# EAGLE design El-Fueradoro_Zuendbox (EAGLE 6.6.0)
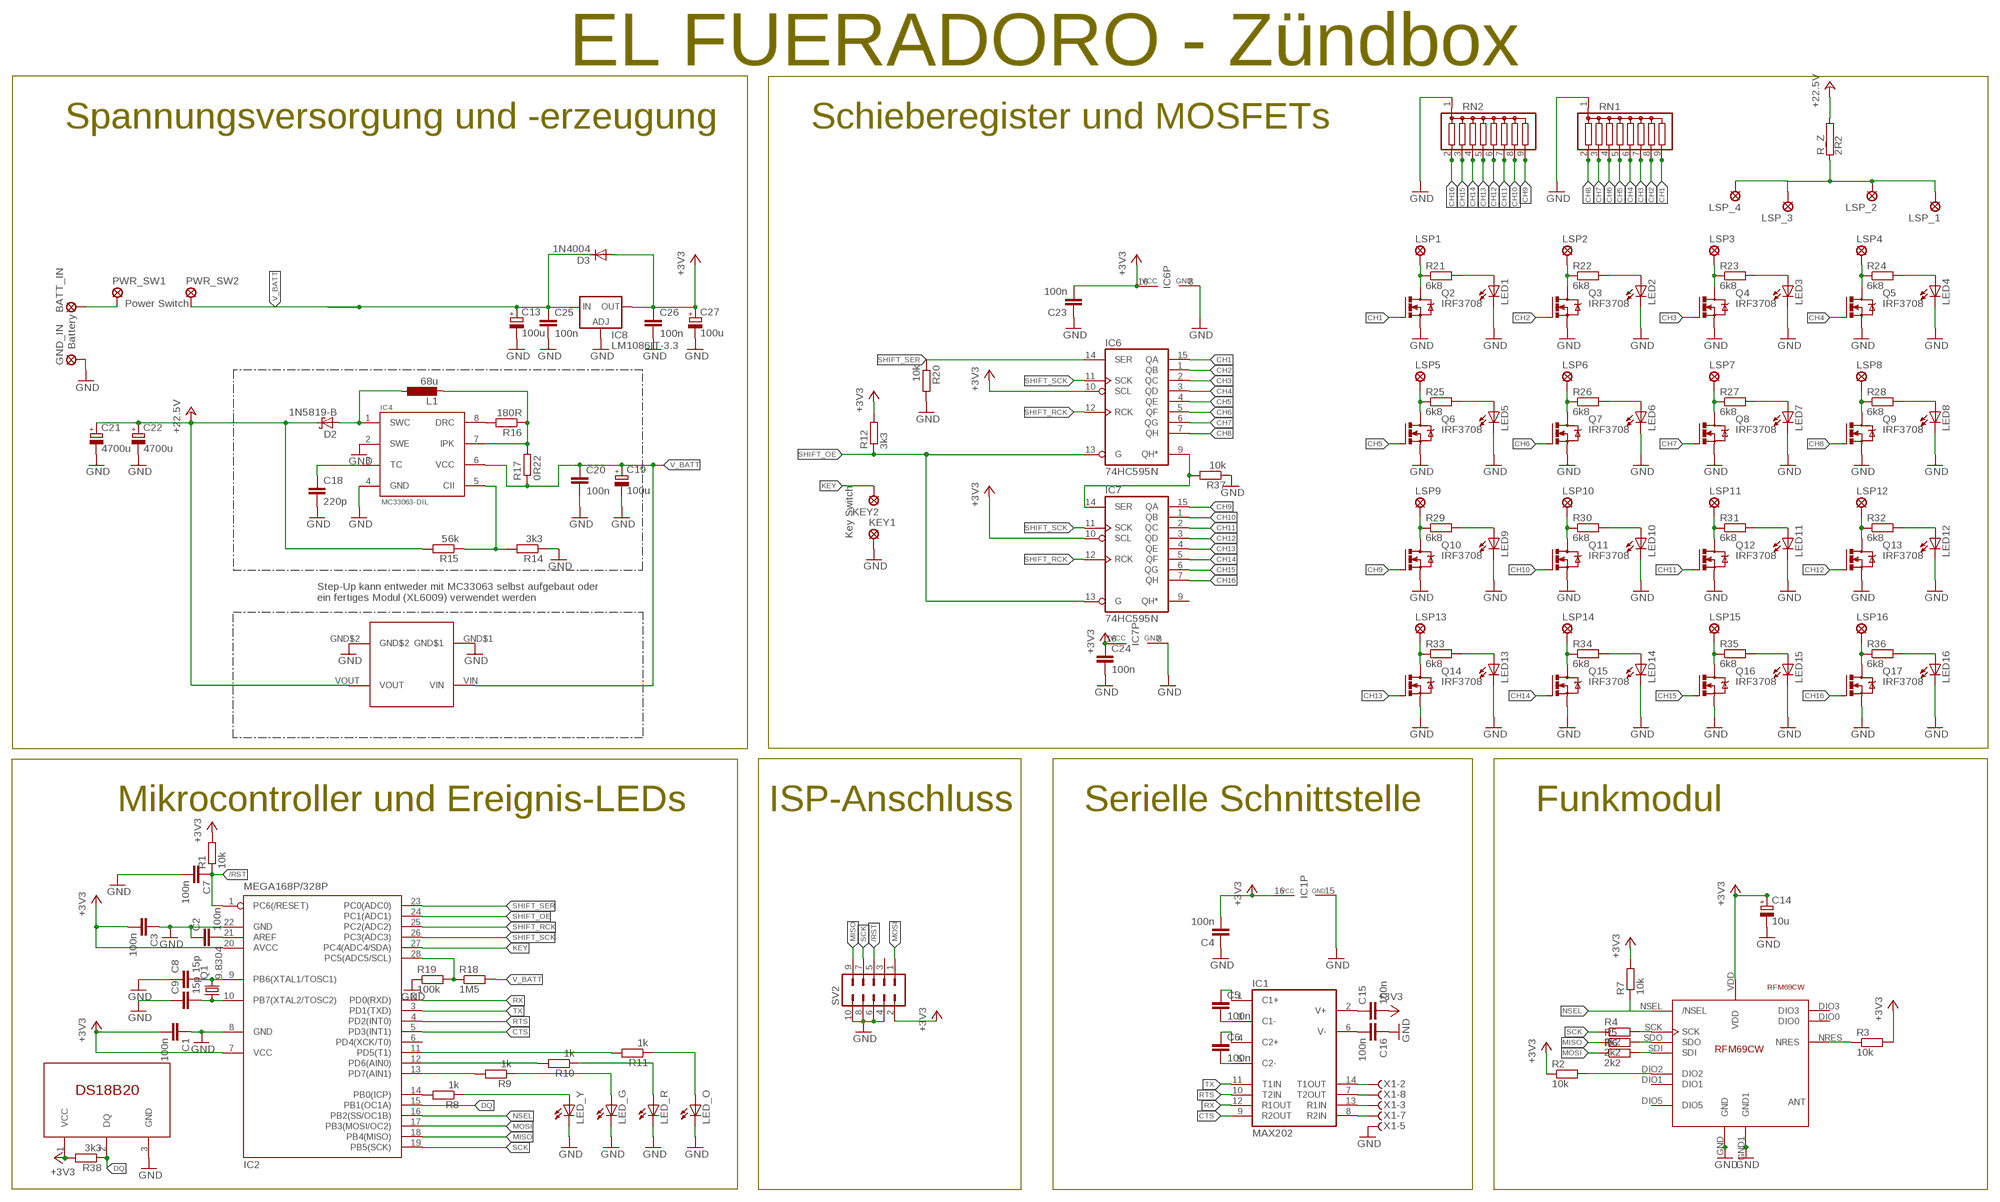
[diagram p0: schematic, sheet 1]

## Parts
BATT_IN  LSP10  [LSP10]
C1  100n  C-EU025-024X044  [C025-024X044]
C2  100n  C-EU025-024X044  [C025-024X044]
C3  100n  C-EU025-024X044  [C025-024X044]
C4  100n  C-EU025-024X044  [C025-024X044]
C5  100n  C-EU025-024X044  [C025-024X044]
C6  100n  C-EU025-024X044  [C025-024X044]
C7  100n  C-EU025-024X044  [C025-024X044]
C8  15p  C-EU025-024X044  [C025-024X044]
C9  15p  C-EU025-024X044  [C025-024X044]
C13  100u  CPOL-EUB45181A  [B45181A]
C14  10u  CPOL-EUB45181A  [B45181A]
C15  100n  C-EU025-024X044  [C025-024X044]
C16  100n  C-EU025-024X044  [C025-024X044]
C18  220p  C-EU025-024X044  [C025-024X044]
C19  100u  CPOL-EUE2,5-6E  [E2,5-6E]
C20  100n  C-EU025-024X044  [C025-024X044]
C21  4700u  CPOL-EUE7.5-18  [E7,5-18]
C22  4700u  CPOL-EUE7.5-18  [E7,5-18]
C23  100n  C-EU025-024X044  [C025-024X044]
C24  100n  C-EU025-024X044  [C025-024X044]
C25  100n  C-EU025-024X044  [C025-024X044]
C26  100n  C-EU025-024X044  [C025-024X044]
C27  100u  CPOL-EUB45181A  [B45181A]
D2  1N5819-B  [DO41-7.6]
D3  1N4004  [DO41-10]
GND_IN  LSP10  [LSP10]
IC1  MAX202  MAX232  [DIL16]
IC2  MEGA168P/328P  MEGA8-P  [DIL28-3]
IC4  MC33063-DIL  MC34063-DIL  [DIL08]
IC6  74HC595N  [DIL16]
IC7  74HC595N  [DIL16]
IC8  LM1086IT-3.3  LD117AV  [TO220L1]
KEY1  LSP10  [LSP10]
KEY2  LSP10  [LSP10]
L1  68u  L-EU0204/5  [0204/5]
LED1  LED3MM  [LED3MM]
LED2  LED3MM  [LED3MM]
LED3  LED3MM  [LED3MM]
LED4  LED3MM  [LED3MM]
LED5  LED3MM  [LED3MM]
LED6  LED3MM  [LED3MM]
LED7  LED3MM  [LED3MM]
LED8  LED3MM  [LED3MM]
LED9  LED3MM  [LED3MM]
LED10  LED3MM  [LED3MM]
LED11  LED3MM  [LED3MM]
LED12  LED3MM  [LED3MM]
LED13  LED3MM  [LED3MM]
LED14  LED3MM  [LED3MM]
LED15  LED3MM  [LED3MM]
LED16  LED3MM  [LED3MM]
LED_G  LED5MM  [LED5MM]
LED_O  LED5MM  [LED5MM]
LED_R  LED5MM  [LED5MM]
LED_Y  LED5MM  [LED5MM]
LSP1  LSP11  [LSP11]
LSP2  LSP11  [LSP11]
LSP3  LSP11  [LSP11]
LSP4  LSP11  [LSP11]
LSP5  LSP11  [LSP11]
LSP6  LSP11  [LSP11]
LSP7  LSP11  [LSP11]
LSP8  LSP11  [LSP11]
LSP9  LSP11  [LSP11]
LSP10  LSP11  [LSP11]
LSP11  LSP11  [LSP11]
LSP12  LSP11  [LSP11]
LSP13  LSP11  [LSP11]
LSP14  LSP11  [LSP11]
LSP15  LSP11  [LSP11]
LSP16  LSP11  [LSP11]
LSP_1  LSP11  [LSP11]
LSP_2  LSP11  [LSP11]
LSP_3  LSP11  [LSP11]
LSP_4  LSP11  [LSP11]
PWR_SW1  LSP10  [LSP10]
PWR_SW2  LSP10  [LSP10]
Q1  9.8304  CRYSTALHC49S  [HC49/S]
Q2  IRF3708  IRF530  [TO220BV]
Q3  IRF3708  IRF530  [TO220BV]
Q4  IRF3708  IRF530  [TO220BV]
Q5  IRF3708  IRF530  [TO220BV]
Q6  IRF3708  IRF530  [TO220BV]
Q7  IRF3708  IRF530  [TO220BV]
Q8  IRF3708  IRF530  [TO220BV]
Q9  IRF3708  IRF530  [TO220BV]
Q10  IRF3708  IRF530  [TO220BV]
Q11  IRF3708  IRF530  [TO220BV]
Q12  IRF3708  IRF530  [TO220BV]
Q13  IRF3708  IRF530  [TO220BV]
Q14  IRF3708  IRF530  [TO220BV]
Q15  IRF3708  IRF530  [TO220BV]
Q16  IRF3708  IRF530  [TO220BV]
Q17  IRF3708  IRF530  [TO220BV]
R1  10k  R-EU_0207/10  [0207/10]
R2  10k  R-EU_0207/10  [0207/10]
R3  10k  R-EU_0207/10  [0207/10]
R4  2k2  R-EU_0207/10  [0207/10]
R5  2k2  R-EU_0207/10  [0207/10]
R6  2k2  R-EU_0207/10  [0207/10]
R7  10k  R-EU_0207/10  [0207/10]
R8  1k  R-EU_0207/10  [0207/10]
R9  1k  R-EU_0207/10  [0207/10]
R10  1k  R-EU_0207/10  [0207/10]
R11  1k  R-EU_0207/10  [0207/10]
R12  3k3  R-EU_0207/10  [0207/10]
R14  3k3  R-EU_0207/10  [0207/10]
R15  56k  R-EU_0207/10  [0207/10]
R16  180R  R-EU_0207/10  [0207/10]
R17  0R22  R-EU_0207/10  [0207/10]
R18  1M5  R-EU_0207/10  [0207/10]
R19  100k  R-EU_0207/10  [0207/10]
R20  10k  R-EU_0207/10  [0207/10]
R21  6k8  R-EU_0207/10  [0207/10]
R22  6k8  R-EU_0207/10  [0207/10]
R23  6k8  R-EU_0207/10  [0207/10]
R24  6k8  R-EU_0207/10  [0207/10]
R25  6k8  R-EU_0207/10  [0207/10]
R26  6k8  R-EU_0207/10  [0207/10]
R27  6k8  R-EU_0207/10  [0207/10]
R28  6k8  R-EU_0207/10  [0207/10]
R29  6k8  R-EU_0207/10  [0207/10]
R30  6k8  R-EU_0207/10  [0207/10]
R31  6k8  R-EU_0207/10  [0207/10]
R32  6k8  R-EU_0207/10  [0207/10]
R33  6k8  R-EU_0207/10  [0207/10]
R34  6k8  R-EU_0207/10  [0207/10]
R35  6k8  R-EU_0207/10  [0207/10]
R36  6k8  R-EU_0207/10  [0207/10]
R37  10k  R-EU_0207/10  [0207/10]
R38  3k3  R-EU_0207/10  [0207/10]
R_Z  2R2  RKH214-8R  [KH214R-8]
RN1  G08R  [SIL9]
RN2  G08R  [SIL9]
SV2  ML10  [ML10]
U$2  DS18B20  [TO92-LINE]
U$3  XL6009_MODULED  [XL6009_PACK]
U$4  RFM69CW  [RFM69CW]
X1  F09HPS  [F09HP]

## Nets
+3V3: C1.2 C3.2 C4.2 C14.+ C15.2 C23.2 C24.1 C26.1 C27.+ D3.A IC1.16(VCC) IC2.7(VCC) IC2.20(AVCC) IC6.10(SCL) IC6.16(VCC) IC7.10(SCL) IC7.16(VCC) IC8.2(OUT) R1.2 R2.1 R3.2 R7.2 R12.2 R38.2 SV2.2 U$2.1(VCC) U$4.VDD
+22_5V: C21.+ C22.+ D2.C R15.2 R_Z.2 U$3.VOUT ; supply symbol labelled +22.5V
/RST: C7.1 IC2.1(PC6(/RESET)) R1.1 SV2.5
CH1: IC6.15(QA) Q2.G RN1.9
CH2: IC6.1(QB) Q3.G RN1.8
CH3: IC6.2(QC) Q4.G RN1.7
CH4: IC6.3(QD) Q5.G RN1.6
CH5: IC6.4(QE) Q6.G RN1.5
CH6: IC6.5(QF) Q7.G RN1.4
CH7: IC6.6(QG) Q8.G RN1.3
CH8: IC6.7(QH) Q9.G RN1.2
CH9: IC7.15(QA) Q10.G RN2.9
CH10: IC7.1(QB) Q11.G RN2.8
CH11: IC7.2(QC) Q12.G RN2.7
CH12: IC7.3(QD) Q13.G RN2.6
CH13: IC7.4(QE) Q14.G RN2.5
CH14: IC7.5(QF) Q15.G RN2.4
CH15: IC7.6(QG) Q16.G RN2.3
CH16: IC7.7(QH) Q17.G RN2.2
CTS: IC1.9(R2OUT) IC2.5(PD3(INT1))
DQ: IC2.15(PB1(OC1A)) R38.1 U$2.2(DQ)
GND: C1.1 C2.1 C3.1 C4.1 C7.2 C8.1 C9.1 C13.- C14.- C16.1 C18.2 C19.- C20.2 C21.- C22.- C23.1 C24.2 C25.2 C26.2 C27.- GND_IN.MP IC1.15(GND) IC2.8(GND) IC2.22(GND) IC4.2(SWE) IC4.4(GND) IC6.8(GND) IC7.8(GND) IC8.1(ADJ) KEY1.MP LED1.K(C) LED2.K(C) LED3.K(C) LED4.K(C) LED5.K(C) LED6.K(C) LED7.K(C) LED8.K(C) LED9.K(C) LED10.K(C) LED11.K(C) LED12.K(C) LED13.K(C) LED14.K(C) LED15.K(C) LED16.K(C) LED_G.K(C) LED_O.K(C) LED_R.K(C) LED_Y.K(C) Q2.S Q3.S Q4.S Q5.S Q6.S Q7.S Q8.S Q9.S Q10.S Q11.S Q12.S Q13.S Q14.S Q15.S Q16.S Q17.S R14.1 R19.1 R20.2 R37.1 RN1.1 RN2.1 SV2.4 SV2.6 SV2.8 SV2.10 U$2.3(GND) U$3.GND$1 U$3.GND$2 U$4.GND U$4.GND1 X1.5(-5:F)
KEY: IC2.27(PC4(ADC4/SDA)) KEY2.MP
MISO: IC2.18(PB4(MISO)) R5.1 SV2.9
MOSI: IC2.17(PB3(MOSI/OC2)) R6.1 SV2.1
N$1: BATT_IN.MP PWR_SW1.MP
N$9: R2.2 U$4.DIO2
N$10: R4.2 U$4.SCK
N$11: R5.2 U$4.SDO
N$12: R6.2 U$4.SDI
N$13: R3.1 U$4.NRES
N$17: C2.2 IC2.21(AREF)
N$18: C9.2 IC2.10(PB7(XTAL2/TOSC2)) Q1.1
N$19: C5.1 IC1.1(C1+)
N$20: C5.2 IC1.3(C1-)
N$21: C6.1 IC1.4(C2+)
N$22: C6.2 IC1.5(C2-)
N$23: C8.2 IC2.9(PB6(XTAL1/TOSC1)) Q1.2
N$27: IC2.13(PD7(AIN1)) R9.2
N$28: IC2.12(PD6(AIN0)) R10.2
N$29: IC2.11(PD5(T1)) R11.2
N$30: LED_O.A R11.1
N$31: IC2.14(PB0(ICP)) R8.2
N$32: LED_R.A R10.1
N$33: LED_G.A R9.1
N$34: LED_Y.A R8.1
N$35: LSP_1.MP LSP_2.MP LSP_3.MP LSP_4.MP R_Z.1
N$37: IC2.28(PC5(ADC5/SCL)) R18.1 R19.2
N$43: C15.1 IC1.2(V+)
N$44: C16.2 IC1.6(V-)
N$45: D2.A IC4.1(SWC) L1.1
N$46: IC4.5(CII) R14.2 R15.1
N$47: IC4.8(DRC) R16.2
N$48: C18.1 IC4.3(TC)
N$49: IC4.7(IPK) L1.2 R16.1 R17.2
N$51: IC6.9(QH*) IC7.14(SER) R37.2
N$52: LSP1.MP Q2.D R21.1
N$53: LSP2.MP Q3.D R22.1
N$54: LSP3.MP Q4.D R23.1
N$55: LSP4.MP Q5.D R24.1
N$56: LSP5.MP Q6.D R25.1
N$57: LSP6.MP Q7.D R26.1
N$58: LSP7.MP Q8.D R27.1
N$59: LSP8.MP Q9.D R28.1
N$60: LSP9.MP Q10.D R29.1
N$61: LSP10.MP Q11.D R30.1
N$62: LSP11.MP Q12.D R31.1
N$63: LSP12.MP Q13.D R32.1
N$64: LSP13.MP Q14.D R33.1
N$65: LSP14.MP Q15.D R34.1
N$66: LSP15.MP Q16.D R35.1
N$67: LSP16.MP Q17.D R36.1
N$72: LED1.A R21.2
N$73: LED2.A R22.2
N$74: LED3.A R23.2
N$75: LED4.A R24.2
N$76: LED5.A R25.2
N$77: LED6.A R26.2
N$78: LED7.A R27.2
N$79: LED8.A R28.2
N$80: LED9.A R29.2
N$81: LED10.A R30.2
N$82: LED11.A R31.2
N$83: LED12.A R32.2
N$84: LED13.A R33.2
N$85: LED14.A R34.2
N$86: LED15.A R35.2
N$87: LED16.A R36.2
NSEL: IC2.16(PB2(SS/OC1B)) R7.1 U$4.NSEL(/NSEL)
PC_CTS_IN: IC1.7(T2OUT) X1.8(-8:F)
PC_RTS_OUT: IC1.8(R2IN) X1.7(-7:F)
PC_RX_IN: IC1.14(T1OUT) X1.2(-2:F)
PC_TX_OUT: IC1.13(R1IN) X1.3(-3:F)
RTS: IC1.10(T2IN) IC2.4(PD2(INT0))
RX: IC1.12(R1OUT) IC2.2(PD0(RXD))
SCK: IC2.19(PB5(SCK)) R4.1 SV2.7
SHIFT_OE: IC2.24(PC1(ADC1)) IC6.13(G) IC7.13(G) R12.1
SHIFT_RCK: IC2.25(PC2(ADC2)) IC6.12(RCK) IC7.12(RCK)
SHIFT_SCK: IC2.26(PC3(ADC3)) IC6.11(SCK) IC7.11(SCK)
SHIFT_SER: IC2.23(PC0(ADC0)) IC6.14(SER) R20.1
TX: IC1.11(T1IN) IC2.3(PD1(TXD))
V_BATT: C13.+ C19.+ C20.1 C25.1 D3.C IC4.6(VCC) IC8.3(IN) PWR_SW2.MP R17.1 R18.2 U$3.VIN
Unconnected: IC2.6(PD4(XCK/T0)) IC7.9(QH*) SV2.3 U$4.DIO0 U$4.DIO1 U$4.DIO3 U$4.DIO5 X1.1(-1:F) X1.4(-4:F) X1.6(-6:F) X1.9(-9:F) X1.G1(-G:G1) X1.G2(-G:G2)

## Notes on the sheet
- EL FUERADORO - Zündbox
- Spannungsversorgung und -erzeugung | Schieberegister und MOSFETs
- Power Switch
- Battery
- Key Switch
- Step-Up kann entweder mit MC33063 selbst aufgebaut oder
  ein fertiges Modul (XL6009) verwendet werden
- Mikrocontroller und Ereignis-LEDs | ISP-Anschluss | Serielle Schnittstelle | Funkmodul

## Library data of the parts
BATT_IN GND_IN KEY1 KEY2 PWR_SW1 PWR_SW2 = solpad:LSP10: SOLDER PAD drill 1.0 mm, distributor Buerklin, 12H555
C1-C9 C15 C16 C18 C20 C23-C26 = rcl:C-EU: CAPACITOR, European symbol
C13 C14 C19 C21 C22 C27 = rcl:CPOL-EU: POLARIZED CAPACITOR, European symbol
D2 = diode:1N581*: 1.0A SCHOTTKY BARRIER RECTIFIER Source: http://www.diodes.com/datasheets/ds23001.pdf
D3 = diode:1N4004: DIODE general purpose rectifier, 1 A
IC1 = maxim:MAX232: RS232 TRANSCEIVER; MF: MAXIM; MPN: MAX232ACPE+; OC_FARNELL: 9723773; OC_NEWARK: 68K4544
IC2 = atmel:MEGA8-P: MICROCONTROLLER 8 Kbytes FLASH, 1 kbytes SRAM, 512 bytes EEPROM, USART, 4-channel 10 bit ADC, 2-channel 8 bit ADC Pin compatible with Atmega48, ATMega88, ATMega168 Source: avr.lbr; OC_FARNELL: unknown; OC_NEWARK: unknown
IC4 = mc34063:MC34063-DIL: DC/DC converter MC34063 in DIL08.
IC6 IC7 = 74xx-eu:74*595: 8-bit SHIFT REGISTER, output latch
IC8 = v-reg:LD117A?*: Low drop fixed and adjustable positive voltage regulators 1 A Source: http://www.st.com/stonline/products/literature/ds/7194/ld1117axx.pdf
L1 = rcl:L-EU: INDUCTOR, European symbol
LED1-LED16 LED_G LED_O LED_R LED_Y = led:LED: LED OSRAM: - CHIPLED LG R971, LG N971, LY N971, LG Q971, LY Q971, LO R971, LY R971 LH N974, LH R974 LS Q976, LO Q976, LY Q976 LO Q996 - Hyper CHIPLED LW Q18S LB Q993, LB Q99A, LB R99A - SideLED LS A670, LO A670, LY A670, LG A670, LP A670 LB A673, LV A673, LT A673, LW A673 LH A674 LY A675 LS A676, LA A676, LO A676, LY A676, LW A676 LS A679, LY A679, LG A679 - Hyper Micro SIDELED® LS Y876, LA Y876, LO Y876, LY Y876 LT Y87S - SmartLED LW L88C, LW L88S LB L89C, LB L89S, LG L890 LS L89K, LO L89K, LY L89K LS L896, LA L896, LO L896, LY L896 - TOPLED LS T670, LO T670, LY T670, LG T670, LP T670 LSG T670, LSP T670, LSY T670, LOP T670, LYG T670 LG T671, LOG T671, LSG T671 LB T673, LV T673, LT T673, LW T673 LH T674 LS T676, LA T676, LO T676, LY T676, LB T676, LH T676, LSB T676, LW T676 LB T67C, LV T67C, LT T67C, LS T67K, LO T67K, LY T67K, LW E67C LS E67B, LA E67B, LO E67B, LY E67B, LB E67C, LV E67C, LT E67C LW T67C LS T679, LY T679, LG T679 LS T770, LO T770, LY T770, LG T770, LP T770 LB T773, LV T773, LT T773, LW T773 LH T774 LS E675, LA E675, LY E675, LS T675 LS T776, LA T776, LO T776, LY T776, LB T776 LHGB T686 LT T68C, LB T68C - Hyper Mini TOPLED® LB M676 - Mini TOPLED Santana® LG M470 LS M47K, LO M47K, LY M47K Source: http://www.osram.convergy.de LUXEON: - LUMILED® LXK2-PW12-R00, LXK2-PW12-S00, LXK2-PW14-U00, LXK2-PW14-V00 LXK2-PM12-R00, LXK2-PM12-S00, LXK2-PM14-U00 LXK2-PE12-Q00, LXK2-PE12-R00, LXK2-PE12-S00, LXK2-PE14-T00, LXK2-PE14-U00 LXK2-PB12-K00, LXK2-PB12-L00, LXK2-PB12-M00, LXK2-PB14-N00, LXK2-PB14-P00, LXK2-PB14-Q00 LXK2-PR12-L00, LXK2-PR12-M00, LXK2-PR14-Q00, LXK2-PR14-R00 LXK2-PD12-Q00, LXK2-PD12-R00, LXK2-PD12-S00 LXK2-PH12-R00, LXK2-PH12-S00 LXK2-PL12-P00, LXK2-PL12-Q00, LXK2-PL12-R00 Source: www.luxeon.com KINGBRIGHT: KA-3528ASYC Source: www.kingbright.com
LSP1-LSP16 LSP_1-LSP_4 = solpad:LSP11: SOLDER PAD drill 1.1 mm
Q1 = crystal:CRYSTAL: CRYSTAL; OC_FARNELL: 1667008; OC_NEWARK: unknown
Q2-Q17 = transistor-power:IRF530: HEXFET Power MOSFET
R1-R12 R14-R38 = rcl:R-EU_: RESISTOR, European symbol
R_Z = resistor-power:R: Power Resitor; OC_FARNELL: unknown; OC_NEWARK: unknown
RN1 RN2 = resistor-sil:G08R: SIL RESISTOR; OC_FARNELL: unknown; OC_NEWARK: unknown
SV2 = fp:ML10: HARTING; OC_FARNELL: unknown; OC_NEWARK: unknown
U$2 = fp:DS18B20
U$3 = fp:XL6009_MODULE
U$4 = fp:RFM69CW
X1 = fp:F09HPS: SUB-D; OC_FARNELL: unknown; OC_NEWARK: unknown

## Board
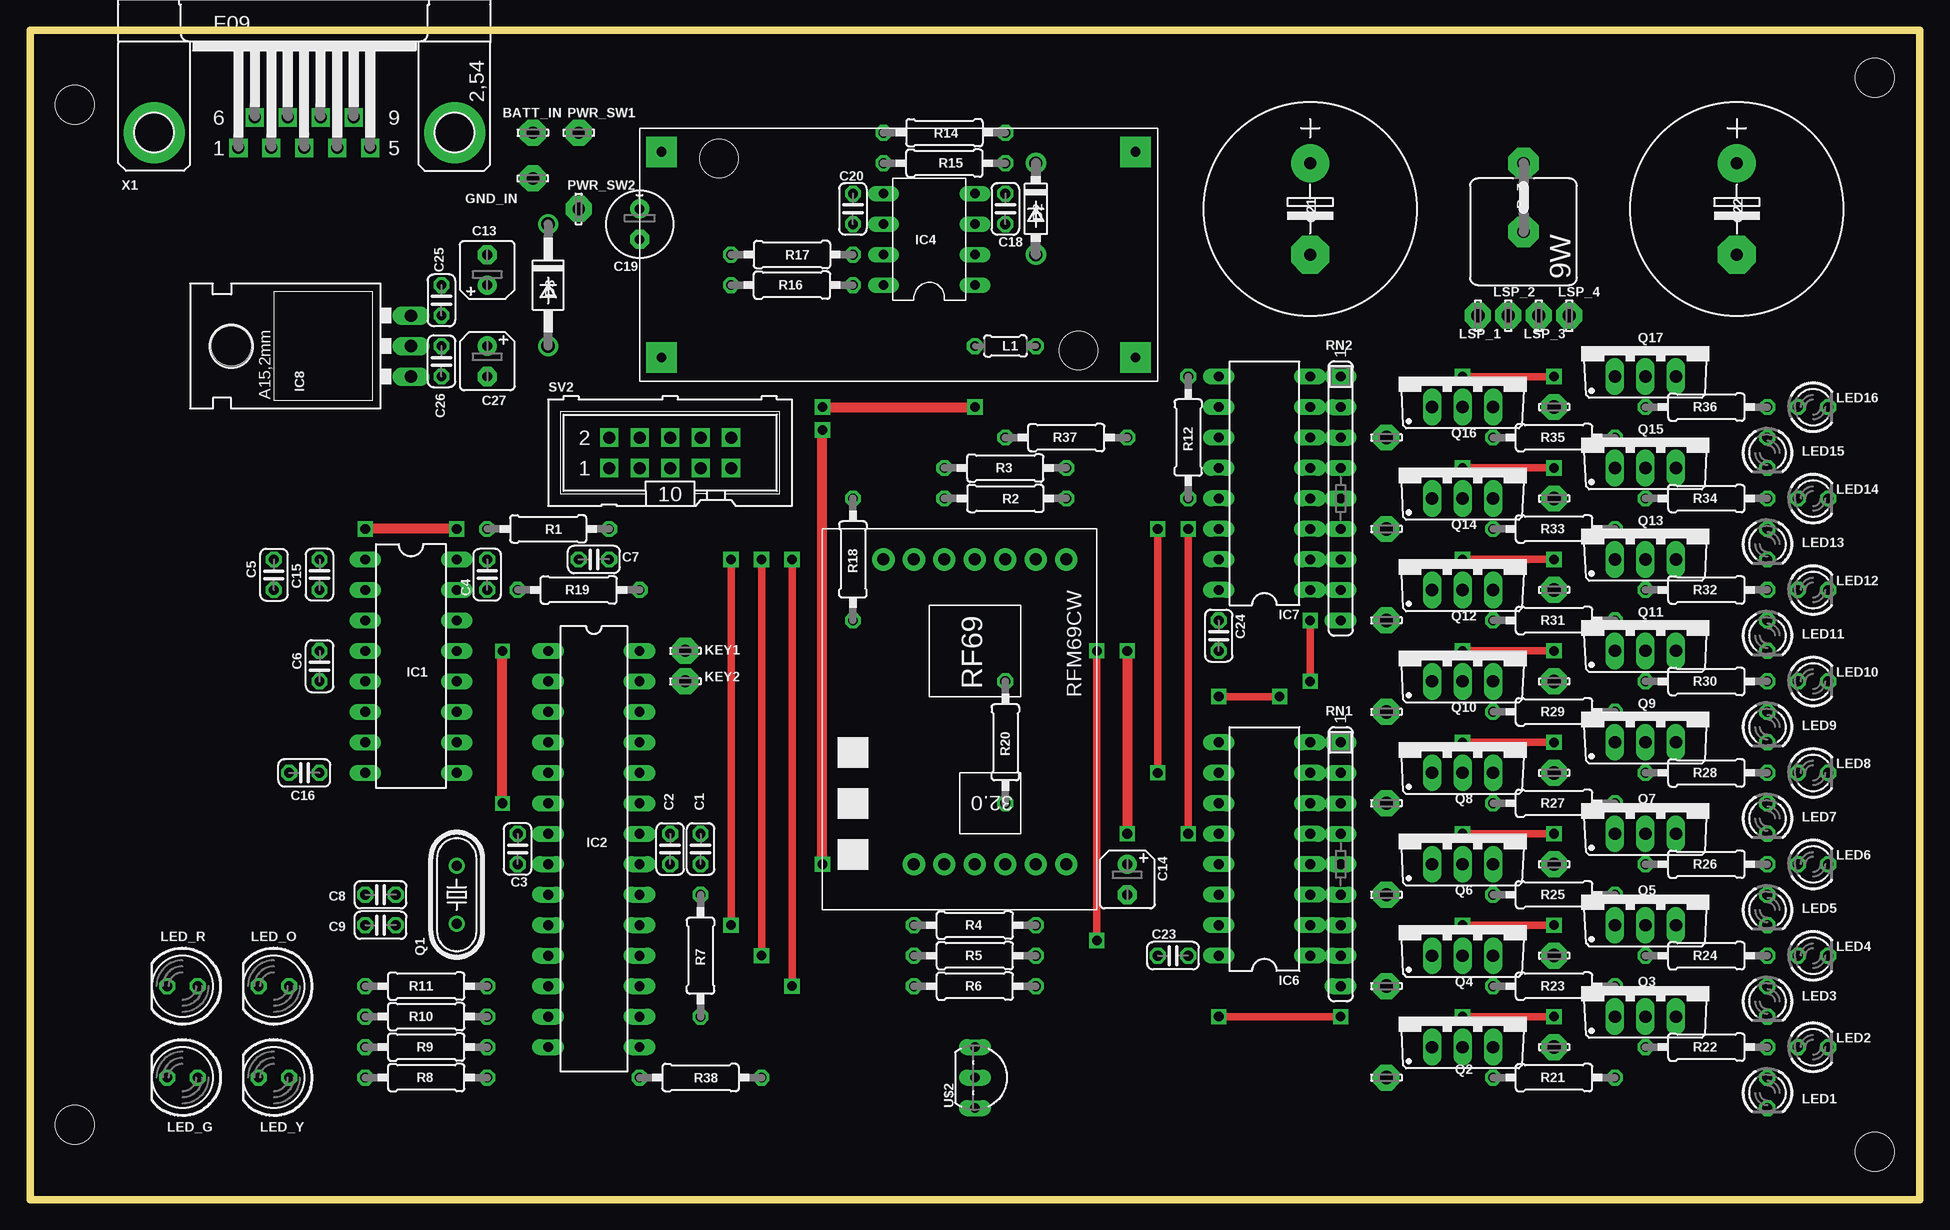
[diagram p1: board, top side]
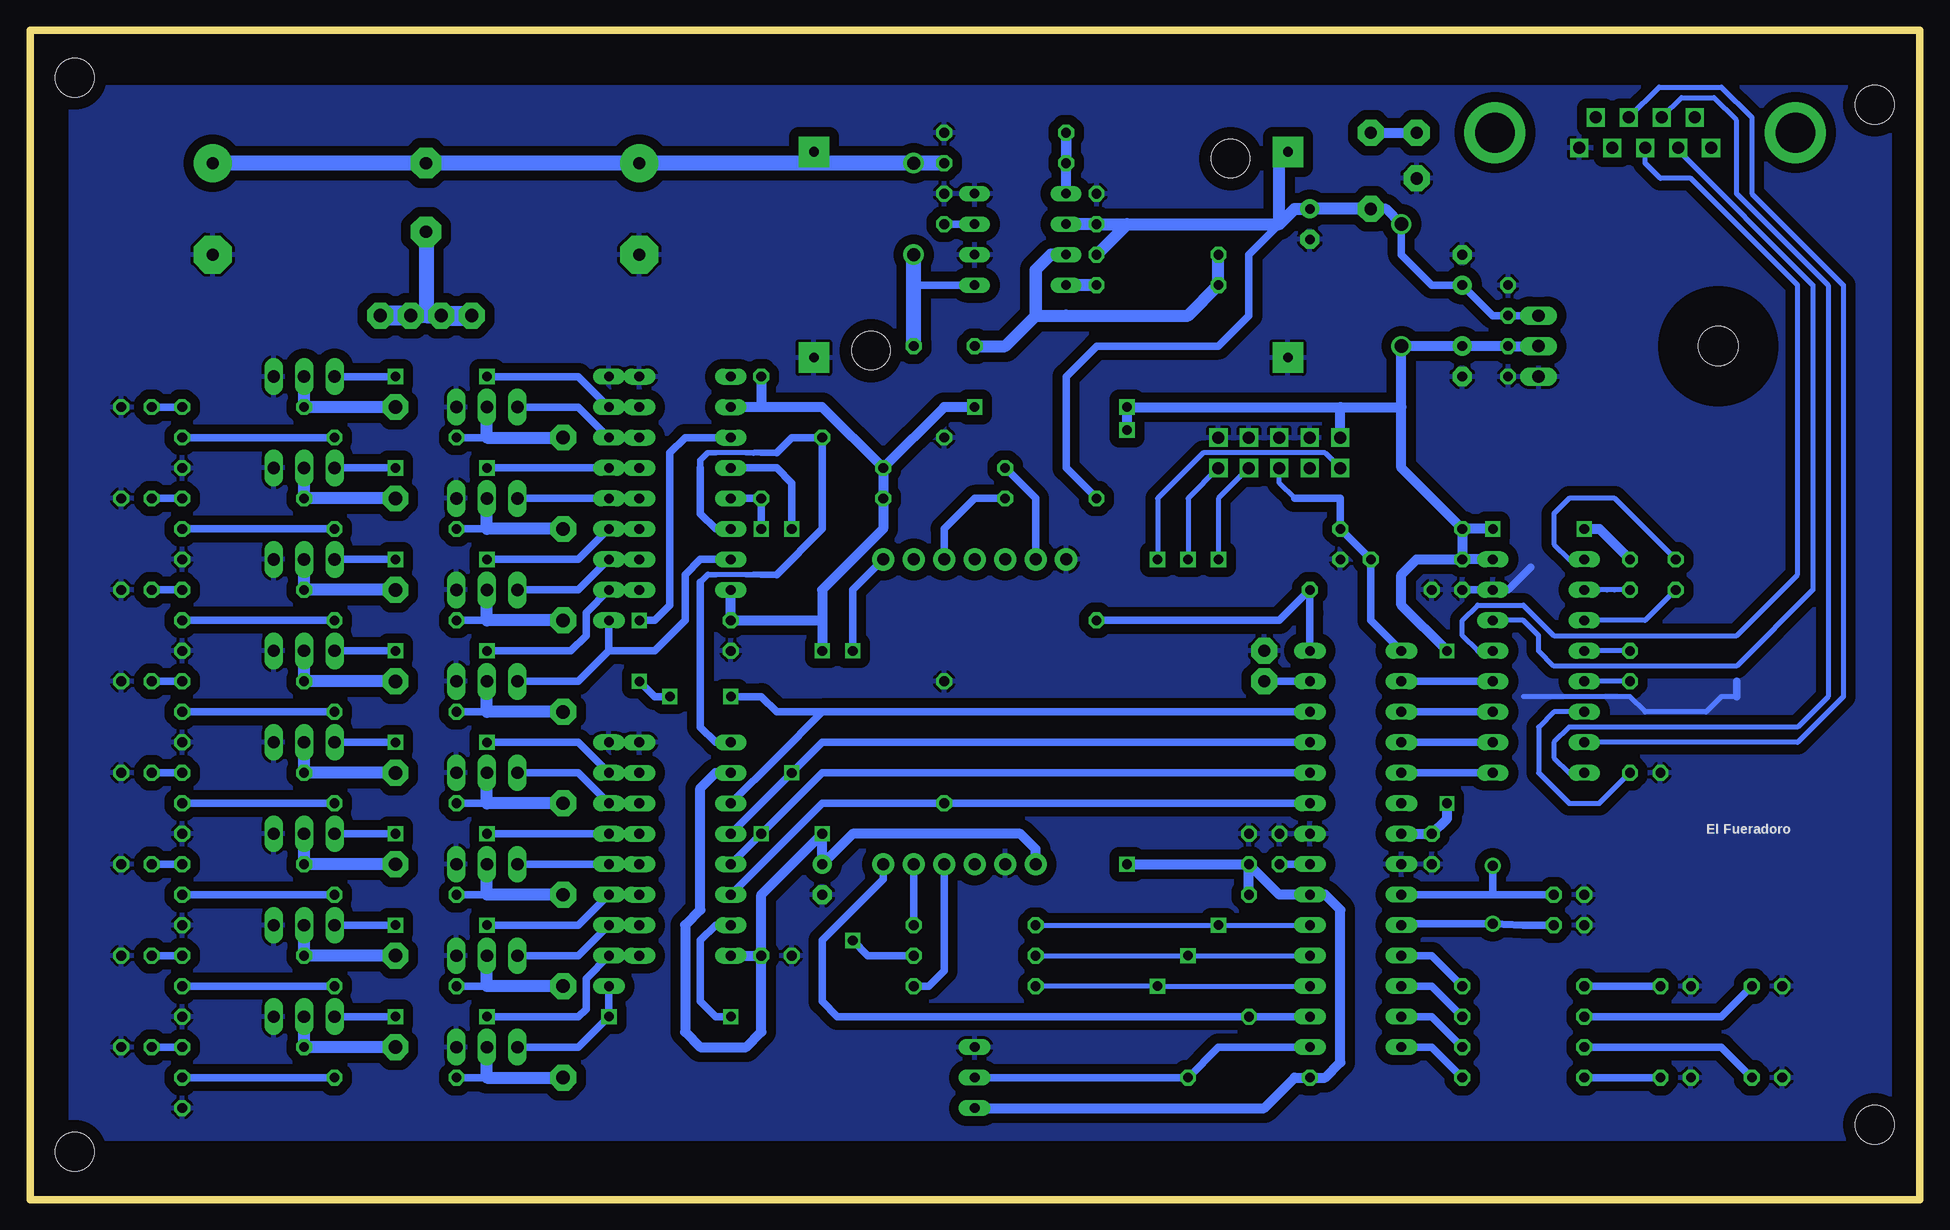
[diagram p2: board, bottom side, seen from below]

Size 157.46 x 97.46 mm. Coordinates in mm from the lower left corner, seen from the top.
Outline: 0,97.46 0,0 157.46,0 157.46,97.46 0,97.46
Copper layers (1*16): Top 0.035mm / dielectric 1.5mm / Bottom 0.035mm
Design rules "Bilex DRU": minimum track width 10mil, minimum drill 24mil, track to track 10mil, track to pad 10mil, pad to pad 10mil, via to via 10mil, smd to smd 10mil, copper to edge 40mil, drill to drill 8mil, minimum pad ring 10mil, minimum via ring 8mil, stop-mask expansion 4mil, vias tented up to drill 0mil, thermal gap 10mil
Holes 3.2 mm at 3.73,6.23 3.73,91.23 153.73,3.98 153.73,93.48

### Footprints (pad centres in the part's own frame; a part is rotated, then mirrored left to right if it is on the bottom)
LSP10 = drill 1.016 pad 2.159 octagon: MP 0,0
C025-024X044 = drill 0.813 octagon: 1 -1.27,0; 2 1.27,0
B45181A = drill 0.813 pad 1.6: + -1.27,0 | drill 0.813 pad 1.6 octagon: - 1.27,0
E2,5-6E = drill 0.813 pad 1.575: + -1.27,0 | drill 0.813 pad 1.575 octagon: - 1.27,0
E7,5-18 = drill 1.016 pad 3.15: + -3.81,0 | drill 1.016 pad 3.15 octagon: - 3.81,0
DO41-7.6 = drill 1.1 pad 1.7: A 3.81,0; C -3.81,0
DO41-10 = drill 1.118: A 5.08,0; C -5.08,0
DIL16 = drill 0.813 long: 1 -8.89,-3.81; 2 -6.35,-3.81; 3 -3.81,-3.81; 4 -1.27,-3.81; 5 1.27,-3.81; 6 3.81,-3.81; 7 6.35,-3.81; 8 8.89,-3.81; 9 8.89,3.81; 10 6.35,3.81; 11 3.81,3.81; 12 1.27,3.81; 13 -1.27,3.81; 14 -3.81,3.81; 15 -6.35,3.81; 16 -8.89,3.81
DIL28-3 = drill 0.813 long: 1 -16.51,-3.81; 2 -13.97,-3.81; 3 -11.43,-3.81; 4 -8.89,-3.81; 5 -6.35,-3.81; 6 -3.81,-3.81; 7 -1.27,-3.81; 8 1.27,-3.81; 9 3.81,-3.81; 10 6.35,-3.81; 11 8.89,-3.81; 12 11.43,-3.81; 13 13.97,-3.81; 14 16.51,-3.81; 15 16.51,3.81; 16 13.97,3.81; 17 11.43,3.81; 18 8.89,3.81; 19 6.35,3.81; 20 3.81,3.81; 21 1.27,3.81; 22 -1.27,3.81; 23 -3.81,3.81; 24 -6.35,3.81; 25 -8.89,3.81; 26 -11.43,3.81; 27 -13.97,3.81; 28 -16.51,3.81
DIL08 = drill 0.8 long: 1 -3.81,-3.81; 2 -1.27,-3.81; 3 1.27,-3.81; 4 3.81,-3.81; 5 3.81,3.81; 6 1.27,3.81; 7 -1.27,3.81; 8 -3.81,3.81
TO220L1 = drill 1.016 long: 1 -2.54,-3.81; 2 0,-3.81; 3 2.54,-3.81 | hole 3.302: 0,11.176
0204/5 = drill 0.813 octagon: 1 -2.54,0; 2 2.54,0
LED3MM = drill 0.813 octagon: A -1.27,0; K 1.27,0
LED5MM = drill 0.813 octagon: A -1.27,0; K 1.27,0
LSP11 = drill 1.118 pad 2.159 octagon: MP 0,0
HC49/S = drill 0.813: 1 -2.413,0; 2 2.413,0
TO220BV = drill 1.016 long: D 0,-2.54; G -2.54,-2.54; S 2.54,-2.54
0207/10 = drill 0.813 octagon: 1 -5.08,0; 2 5.08,0
KH214R-8 = drill 1.016 pad 2.54 octagon: 1 -2.54,0; 2 3.175,0
SIL9 = drill 0.813 long: 1 -10.16,0; 2 -7.62,0; 3 -5.08,0; 4 -2.54,0; 5 0,0; 6 2.54,0; 7 5.08,0; 8 7.62,0; 9 10.16,0
ML10 = drill 1 pad 1.5 square: 1 -5.08,-1.27; 2 -5.08,1.27; 3 -2.54,-1.27; 4 -2.54,1.27; 5 0,-1.27; 6 0,1.27; 7 2.54,-1.27; 8 2.54,1.27; 9 5.08,-1.27; 10 5.08,1.27
TO92-LINE = drill 0.813 long: 1 -2.54,1.27; 2 0,1.27; 3 2.54,1.27
XL6009_PACK = drill 0.8 pad 2.54 square: GND$1 -19.75,-8.573; GND$2 19.75,-8.573; VIN -19.75,8.573; VOUT 19.75,8.573 | hole 3.2: -14.986,8.001; 14.986,-8.001
RFM69CW = drill 1 pad 1.85: DIO0 -12.7,5.08; DIO1 -12.7,0; DIO2 -12.7,2.54; DIO3 12.7,0; DIO5 -12.7,-2.54; GND -12.7,-7.62; GND1 12.7,-2.54; NRES -12.7,-5.08; NSEL 12.7,7.62; SCK 12.7,5.08; SDI 12.7,2.54; SDO -12.7,7.62; VDD 12.7,-5.08
F09HP = drill 1 pad 1.5 square: 1 -5.486,-1.27; 2 -2.743,-1.27; 3 0,-1.27; 4 2.743,-1.27; 5 5.486,-1.27; 6 -4.115,1.27; 7 -1.372,1.27; 8 1.372,1.27; 9 4.115,1.27 | drill 3.302 pad 5.08: G1 -12.522,0; G2 12.522,0

### Placement (x,y rotation side)
BATT_IN  41.91,88.9 0 top
C1  55.88,29.21 270 top
C2  53.34,29.21 270 top
C3  40.64,29.21 90 top
C4  38.1,52.07 90 top
C5  20.32,52.07 270 top
C6  24.13,44.45 270 top
C7  46.99,53.34 0 top
C8  29.21,25.4 0 top
C9  29.21,22.86 0 top
C13  38.1,77.47 90 top
C14  91.44,26.67 270 top
C15  24.13,52.07 90 top
C16  22.86,35.56 0 top
C18  81.28,82.55 90 top
C19  50.8,81.28 270 top
C20  68.58,82.55 90 top
C21  106.68,82.55 270 top
C22  142.24,82.55 270 top
C23  95.25,20.32 0 top
C24  99.06,46.99 270 top
C25  34.29,74.93 90 top
C26  34.29,69.85 270 top
C27  38.1,69.85 270 top
D2  83.82,82.55 270 top
D3  43.18,76.2 270 top
GND_IN  41.91,85.09 180 top
IC1  31.75,44.45 270 top
IC2  46.99,29.21 270 top
IC4  74.93,80.01 90 top
IC6  102.87,29.21 90 top
IC7  102.87,59.69 90 top
IC8  27.94,71.12 90 top
KEY1  54.61,45.72 0 top
KEY2  54.61,43.18 0 top
L1  81.28,71.12 180 top
LED1  144.78,8.89 270 top
LED2  148.59,12.7 0 top
LED3  144.78,16.51 270 top
LED4  148.59,20.32 0 top
LED5  144.78,24.13 270 top
LED6  148.59,27.94 0 top
LED7  144.78,31.75 270 top
LED8  148.59,35.56 0 top
LED9  144.78,39.37 270 top
LED10  148.59,43.18 0 top
LED11  144.78,46.99 270 top
LED12  148.59,50.8 0 top
LED13  144.78,54.61 270 top
LED14  148.59,58.42 0 top
LED15  144.78,62.23 270 top
LED16  148.59,66.04 0 top
LED_G  12.7,10.16 180 top
LED_O  20.32,17.78 180 top
LED_R  12.7,17.78 180 top
LED_Y  20.32,10.16 180 top
LSP1  113.03,10.16 0 top
LSP2  127,12.7 0 top
LSP3  113.03,17.78 0 top
LSP4  127,20.32 0 top
LSP5  113.03,25.4 0 top
LSP6  127,27.94 0 top
LSP7  113.03,33.02 0 top
LSP8  127,35.56 0 top
LSP9  113.03,40.64 0 top
LSP10  127,43.18 0 top
LSP11  113.03,48.26 0 top
LSP12  127,50.8 0 top
LSP13  113.03,55.88 0 top
LSP14  127,58.42 0 top
LSP15  113.03,63.5 0 top
LSP16  127,66.04 0 top
LSP_1  120.65,73.66 90 top
LSP_2  123.19,73.66 90 top
LSP_3  125.73,73.66 90 top
LSP_4  128.27,73.66 90 top
PWR_SW1  45.72,88.9 0 top
PWR_SW2  45.72,82.55 90 top
Q1  35.56,25.4 90 top
Q2  119.38,15.24 0 top
Q3  134.62,17.78 0 top
Q4  119.38,22.86 0 top
Q5  134.62,25.4 0 top
Q6  119.38,30.48 0 top
Q7  134.62,33.02 0 top
Q8  119.38,38.1 0 top
Q9  134.62,40.64 0 top
Q10  119.38,45.72 0 top
Q11  134.62,48.26 0 top
Q12  119.38,53.34 0 top
Q13  134.62,55.88 0 top
Q14  119.38,60.96 0 top
Q15  134.62,63.5 0 top
Q16  119.38,68.58 0 top
Q17  134.62,71.12 0 top
R1  43.18,55.88 180 top
R2  81.28,58.42 180 top
R3  81.28,60.96 0 top
R4  78.74,22.86 0 top
R5  78.74,20.32 0 top
R6  78.74,17.78 0 top
R7  55.88,20.32 90 top
R8  33.02,10.16 0 top
R9  33.02,12.7 0 top
R10  33.02,15.24 0 top
R11  33.02,17.78 0 top
R12  96.52,63.5 90 top
R14  76.2,88.9 180 top
R15  76.2,86.36 0 top
R16  63.5,76.2 0 top
R17  63.5,78.74 180 top
R18  68.58,53.34 90 top
R19  45.72,50.8 0 top
R20  81.28,38.1 90 top
R21  127,10.16 0 top
R22  139.7,12.7 0 top
R23  127,17.78 0 top
R24  139.7,20.32 0 top
R25  127,25.4 0 top
R26  139.7,27.94 0 top
R27  127,33.02 0 top
R28  139.7,35.56 0 top
R29  127,40.64 0 top
R30  139.7,43.18 0 top
R31  127,48.26 0 top
R32  139.7,50.8 0 top
R33  127,55.88 0 top
R34  139.7,58.42 0 top
R35  127,63.5 0 top
R36  139.7,66.04 0 top
R37  86.36,63.5 0 top
R38  55.88,10.16 180 top
R_Z  124.46,83.19 90 top
RN1  109.22,27.94 270 top
RN2  109.22,58.42 270 top
SV2  53.34,62.23 0 top
U$2  80.01,10.16 90 top
U$3  72.39,78.74 0 top
U$4  78.74,40.64 270 top
X1  22.86,88.9 0 top

### Tracks (layer width: path | path; a pad name or v marks a point on that pad's centre or on a via)
+3V3  (via drill 0.8 pad 0.5, 0.8 pad 1.27)
  Top 0.813: v35.56,55.88 v27.94,55.88 | v91.44,45.72 v91.44,30.48 | v66.04,27.94 v66.04,64.14 | v66.04,66.04 v78.74,66.04 | v39.37,33.02 v39.37,45.72
  Bottom 0.813: IC1.16 C4.2 | v27.94,55.88 27.3,55.88 26.67,55.88 C15.2 | 91.44,48.26 91.44,50.8 86.36,55.88 R2.1 R3.2 | 91.44,48.26 v91.44,45.72 | R7.2 C1.2 | U$4.VDD 73.66,29.21 74.93,30.48 88.9,30.48 C14.+ v91.44,30.48 96.52,25.4 C23.2 | R1.2 C4.2 | U$2.1 54.61,7.62 52.07,10.16 R38.2 49.53,10.16 48.26,11.43 48.26,24.13 49.53,25.4 IC2.20 53.34,25.4 C1.2 | IC6.16 C23.2 | IC6.10 100.33,35.56 101.6,34.29 101.6,24.13 102.87,22.86 102.87,13.97 101.6,12.7 97.79,12.7 96.52,13.97 C23.2 | IC8.2 C26.1 C27.+ D3.A 43.18,66.04 | IC7.16 C24.1 91.44,48.26 | R3.2 91.44,66.04 96.52,66.04 | 96.52,66.04 IC7.10 | R12.2 96.52,66.04 | R3.2 81.28,66.04 v78.74,66.04 | 48.26,66.04 v66.04,66.04 v66.04,64.14 | 48.26,66.04 43.18,66.04 | v35.56,55.88 R1.2 | R1.2 43.18,60.96 43.18,66.04 | v66.04,27.94 C1.2 | SV2.2 48.26,66.04 | IC2.7 C3.2 39.37,31.75 v39.37,33.02 | v39.37,45.72 43.18,49.53 43.18,52.07 41.91,53.34 C4.2
+22_5V
  Bottom 1.27: C22.+ R_Z.2 C21.+ 92.96,86.36 | R15.2 D2.C 92.96,86.36 | 92.96,86.36 U$3.VOUT
/RST
  Bottom 0.406: 52.07,58.42 53.34,59.69 SV2.5
  Bottom 0.61: 52.07,58.42 50.8,58.42 48.26,58.42 R1.1 C7.1 45.72,48.26 IC2.1
CH1  (via drill 0.8 pad 1.27)
  Top 0.61: v99.06,15.24 v109.22,15.24
  Bottom 0.61: v99.06,15.24 100.33,15.24 101.6,16.51 101.6,21.59 100.33,22.86 IC6.15 | Q2.G 111.76,12.7 v109.22,15.24 RN1.9
CH2  (via drill 0.8 pad 1.27)
  Top 0.61: v119.38,15.24 v127,15.24
  Bottom 0.61: IC6.1 RN1.8 111.12,18.41 111.12,15.88 111.76,15.24 v119.38,15.24 | v127,15.24 Q3.G
CH3
  Bottom 0.61: Q4.G 111.76,20.32 RN1.7 IC6.2
CH4  (via drill 0.8 pad 1.27)
  Top 0.61: v119.38,22.86 v127,22.86
  Bottom 0.61: IC6.3 RN1.6 111.76,22.86 v119.38,22.86 | v127,22.86 Q5.G
CH5
  Bottom 0.61: Q6.G RN1.5 IC6.4
CH6  (via drill 0.8 pad 1.27)
  Top 0.61: v119.38,30.48 v127,30.48
  Bottom 0.61: v119.38,30.48 RN1.4 IC6.5 | v127,30.48 Q7.G
CH7
  Bottom 0.61: IC6.6 RN1.3 111.76,35.56 Q8.G
CH8  (via drill 0.8 pad 1.27)
  Top 0.61: v119.38,38.1 v127,38.1
  Bottom 0.61: IC6.7 RN1.2 111.76,38.1 v119.38,38.1 | v127,38.1 Q9.G
CH9
  Bottom 0.61: IC7.15 101.6,53.34 102.87,52.07 102.87,48.26 105.41,45.72 106.68,45.72 107.95,45.72 109.22,45.72 | 109.22,45.72 111.76,43.18 Q10.G | RN2.9 109.22,45.72
CH10  (via drill 0.8 pad 1.27)
  Top 0.61: v119.38,45.72 v127,45.72
  Bottom 0.61: IC7.1 RN2.8 111.12,48.9 111.12,46.99 112.39,45.72 v119.38,45.72 | v127,45.72 Q11.G
CH11
  Bottom 0.61: IC7.2 RN2.7 111.76,50.8 Q12.G
CH12  (via drill 0.8 pad 1.27)
  Top 0.61: v119.38,53.34 v127,53.34
  Bottom 0.61: IC7.3 RN2.6 111.76,53.34 v119.38,53.34 | v127,53.34 Q13.G
CH13
  Bottom 0.61: Q14.G RN2.5 IC7.4
CH14  (via drill 0.8 pad 1.27)
  Top 0.61: v119.38,60.96 v127,60.96
  Bottom 0.61: v119.38,60.96 RN2.4 IC7.5 | v127,60.96 Q15.G
CH15
  Bottom 0.61: IC7.6 RN2.3 111.76,66.04 Q16.G
CH16  (via drill 0.8 pad 1.27)
  Top 0.61: v119.38,68.58 v127,68.58
  Bottom 0.61: IC7.7 RN2.2 111.76,68.58 v119.38,68.58 | v127,68.58 Q17.G
CTS
  Bottom 0.61: IC1.9 IC2.5
DQ
  Bottom 0.61: IC2.15 58.42,12.7 R38.1 U$2.2
GND
  Bottom 0.406: 15.24,41.91 16.51,41.91 17.78,40.64 22.86,40.64 24.13,41.91 33.02,41.91
  Bottom 0.61: 32.38,52.7 34.29,50.8 IC1.15 C4.1 | 15.24,43.18 15.24,41.91
  pour Bottom (isolate 0.813): 2.54,92.71 2.54,5.08 154.02,5.08 154.02,92.71
KEY
  Bottom 0.61: IC2.27 KEY2.MP
MISO  (via drill 0.8 pad 1.27)
  Top 0.61: v60.96,53.34 v60.96,20.32
  Bottom 0.406: R5.1 v60.96,20.32 IC2.18 | v60.96,53.34 60.96,58.42 SV2.9
MOSI  (via drill 0.8 pad 1.27)
  Top 0.61: v63.5,53.34 v63.5,17.78
  Bottom 0.406: R6.1 v63.5,17.78 IC2.17 | v63.5,53.34 63.5,58.42 59.69,62.23 49.53,62.23 SV2.1
N$1
  Bottom 0.813: PWR_SW1.MP BATT_IN.MP
N$9
  Bottom 0.61: U$4.DIO2 81.28,55.88 78.74,58.42 R2.2
N$10
  Bottom 0.61: U$4.SCK R4.2
N$11  (via drill 0.8 pad 1.27)
  Top 0.61: v88.9,21.59 v88.9,45.72
  Bottom 0.61: R5.2 87.63,20.32 v88.9,21.59 | v88.9,45.72 88.9,50.8 U$4.SDO
N$12
  Bottom 0.61: R6.2 82.55,17.78 81.28,19.05 U$4.SDI
N$13
  Bottom 0.61: U$4.NRES 73.66,58.42 R3.1
N$17
  Bottom 0.61: IC2.21 C2.2
N$18
  Bottom 0.61: C9.2 33.02,22.86 Q1.1 43.18,22.99 IC2.10
N$19
  Bottom 0.406: C5.1 25.4,58.42 29.21,58.42 30.48,57.15 30.48,54.61 29.21,53.34 IC1.1
N$20
  Bottom 0.406: C5.2 22.86,48.26 IC1.3
N$21
  Bottom 0.406: C6.1 IC1.4
N$22
  Bottom 0.406: C6.2 IC1.5
N$23
  Bottom 0.61: IC2.9 35.56,25.4 | 35.56,25.4 Q1.2 35.56,27.94 | 35.56,25.4 C8.2
N$27
  Bottom 0.61: R9.2 40.64,15.24 IC2.13
N$28
  Bottom 0.61: R10.2 40.64,17.78 IC2.12
N$29
  Bottom 0.61: R11.2 40.64,20.32 IC2.11
N$30
  Bottom 0.61: LED_O.A R11.1
N$31
  Bottom 0.61: R8.2 40.64,12.7 IC2.14
N$32
  Bottom 0.61: R10.1 16.51,15.24 LED_R.A
N$33
  Bottom 0.61: LED_G.A 16.51,12.7 R9.1
N$34
  Bottom 0.61: LED_Y.A R8.1
N$35
  Bottom 1.27: LSP_2.MP 124.46,73.66 | 124.46,73.66 LSP_3.MP | R_Z.1 124.46,73.66 | 124.46,73.66 LSP_1.MP
  Bottom 1.676: LSP_3.MP LSP_4.MP | LSP_2.MP LSP_1.MP
N$37
  Bottom 0.61: IC2.28 50.8,48.9 R19.2 53.34,48.26 R18.1
N$43
  Bottom 0.406: C15.1 25.4,50.8 26.04,50.8 26.67,50.8 IC1.2
N$44
  Bottom 0.406: IC1.6 30.48,40.64 31.75,39.37 31.75,35.56 29.21,33.02 26.67,33.02 C16.2
N$45
  Bottom 0.61: IC4.1 83.82,76.2
  Bottom 1.27: L1.1 83.82,76.2 D2.A
N$46
  Bottom 0.813: IC4.5 R14.2 R15.1
N$47
  Bottom 1.016: R16.2 IC4.8
N$48
  Bottom 0.61: IC4.3 C18.1
N$49
  Bottom 1.016: L1.2 76.2,71.12 73.66,73.66 | 73.66,73.66 73.66,77.47 | 73.66,77.47 72.39,78.74 | 72.39,78.74 IC4.7 72.39,78.74 | R17.2 R16.1 60.96,73.66 71.12,73.66 73.66,73.66 | 72.39,78.74 73.66,77.47 | 73.66,77.47 73.66,73.66
N$51
  Bottom 0.406: 97.79,62.23 100.33,62.23 | 97.79,52.07 100.33,52.07
  Bottom 0.457: 97.16,62.23 97.79,62.23 | 100.33,62.23 100.97,62.23 | 97.16,52.07 97.79,52.07 | 100.33,52.07 100.97,52.07
  Bottom 0.508: 100.97,52.07 101.6,51.44 | 96.52,62.23 97.16,62.23 | 100.97,62.23 101.6,61.59 | 96.52,52.07 97.16,52.07
  Bottom 0.559: 95.25,62.23 96.52,62.23 | 101.6,61.59 101.6,60.96 | 95.25,52.07 96.52,52.07
  Bottom 0.61: 95.25,52.07 91.44,55.88 91.44,62.23 R37.2 93.98,63.5 95.25,62.23 | 101.6,51.44 101.6,46.99 101.6,45.72 101.6,39.37 100.33,38.1 IC6.9 | IC7.14 100.33,55.88 101.6,57.15 101.6,60.96
N$52
  Bottom 0.61: R21.1 119.38,10.16
  Bottom 1.016: LSP1.MP 119.38,10.16 Q2.D
N$53
  Bottom 1.016: LSP2.MP R22.1 Q3.D
N$54
  Bottom 0.61: R23.1 119.38,17.78
  Bottom 1.016: LSP3.MP 119.38,17.78 Q4.D
N$55
  Bottom 1.016: LSP4.MP R24.1 Q5.D
N$56
  Bottom 0.61: R25.1 119.38,25.4
  Bottom 1.016: LSP5.MP 119.38,25.4 Q6.D
N$57
  Bottom 1.016: LSP6.MP R26.1 Q7.D
N$58
  Bottom 0.61: R27.1 119.38,33.02
  Bottom 1.016: LSP7.MP 119.38,33.02 Q8.D
N$59
  Bottom 1.016: LSP8.MP R28.1 Q9.D
N$60
  Bottom 0.61: R29.1 119.38,40.64
  Bottom 1.016: LSP9.MP 119.38,40.64 Q10.D
N$61
  Bottom 1.016: LSP10.MP R30.1 Q11.D
N$62
  Bottom 0.61: R31.1 119.38,48.26
  Bottom 1.016: LSP11.MP 119.38,48.26 Q12.D
N$63
  Bottom 1.016: LSP12.MP R32.1 Q13.D
N$64
  Bottom 0.61: R33.1 119.38,55.88
  Bottom 1.016: LSP13.MP 119.38,55.88 Q14.D
N$65
  Bottom 1.016: LSP14.MP R34.1 Q15.D
N$66
  Bottom 0.61: R35.1 119.38,63.5
  Bottom 1.016: Q16.D 119.38,63.5 LSP15.MP
N$67
  Bottom 1.016: LSP16.MP R36.1 Q17.D
N$72
  Bottom 0.61: R21.2 LED1.A
N$73
  Bottom 0.61: R22.2 LED2.A
N$74
  Bottom 0.61: R23.2 LED3.A
N$75
  Bottom 0.61: LED4.A R24.2
N$76
  Bottom 0.61: LED5.A R25.2
N$77
  Bottom 0.61: LED6.A R26.2
N$78
  Bottom 0.61: LED7.A R27.2
N$79
  Bottom 0.61: R28.2 LED8.A
N$80
  Bottom 0.61: LED9.A R29.2
N$81
  Bottom 0.61: LED10.A R30.2
N$82
  Bottom 0.61: R31.2 LED11.A
N$83
  Bottom 0.61: LED12.A R32.2
N$84
  Bottom 0.61: LED13.A R33.2
N$85
  Bottom 0.61: LED14.A R34.2
N$86
  Bottom 0.61: LED15.A R35.2
N$87
  Bottom 0.61: LED16.A R36.2
NSEL
  Bottom 0.61: IC2.16 R7.1 90.17,15.24 91.44,16.51 91.44,21.59 86.36,26.67 U$4.NSEL
PC_CTS_IN
  Bottom 0.406: X1.8 21.69,92.71 16.51,92.71 13.97,90.17 13.97,83.82 6.35,76.2 6.35,41.91 10.16,38.1 IC1.7
PC_RTS_OUT
  Bottom 0.406: IC1.8 29.21,35.56 30.48,36.83 30.48,38.1 29.21,39.37 10.16,39.37 7.62,41.91 7.62,76.2 15.24,83.82 15.24,89.92 17.14,91.83 19.83,91.83 X1.7
PC_RX_IN
  Bottom 0.406: X1.2 20.12,87.43 8.89,76.2 8.89,50.8 15.24,44.45 19.05,44.45 30.48,44.45 31.75,45.72 31.75,46.99 33.02,48.26 IC1.14
PC_TX_OUT
  Bottom 0.406: IC1.13 36.83,45.72 38.1,46.99 38.1,48.26 36.83,49.53 33.02,49.53 30.48,46.99 15.24,46.99 10.16,52.07 10.16,53.34 10.16,55.24 10.16,55.88 10.16,76.2 19.05,85.09 21.59,85.09 22.86,86.36 X1.3
RTS
  Bottom 0.61: IC1.10 IC2.4
RX
  Bottom 0.61: IC1.12 IC2.2
SCK  (via drill 0.8 pad 1.27)
  Top 0.61: v58.42,53.34 v58.42,22.86
  Bottom 0.406: R4.1 v58.42,22.86 IC2.19 | v58.42,53.34 58.42,58.42 SV2.7
SHIFT_OE  (via drill 0.8 pad 1.27)
  Top 0.61: v96.52,30.48 v96.52,55.88
  Bottom 0.61: IC6.13 v96.52,30.48 91.44,35.56 IC2.24 | v96.52,55.88 96.52,57.15 R12.1 IC7.13
SHIFT_RCK  (via drill 0.8 pad 1.27)
  Top 0.61: v93.98,35.56 v93.98,55.88
  Bottom 0.61: IC6.12 v93.98,35.56 91.44,38.1 IC2.25 | v93.98,55.88 93.98,59.69 95.25,60.96 IC7.12
SHIFT_SCK  (via drill 0.8 pad 1.27)
  Top 0.61: v106.68,48.26 v106.68,43.18 | v99.06,41.91 v104.14,41.91
  Bottom 0.61: IC7.11 102.87,63.5 104.14,62.23 104.14,49.53 105.41,48.26 v106.68,48.26 | IC2.26 91.44,40.64 | 91.44,40.64 95.25,36.83 | 95.25,36.83 IC6.11 95.25,36.83 | v99.06,41.91 96.52,41.91 95.25,40.64 91.44,40.64 | v104.14,41.91 105.41,41.91 v106.68,43.18
SHIFT_SER
  Bottom 0.61: IC2.23 R20.1 91.44,33.02 IC6.14
TX
  Bottom 0.61: IC1.11 IC2.3
V_BATT
  Bottom 0.61: D3.C 43.18,78.74 40.64,76.2 C13.+ 35.56,73.66 C25.1 IC8.3 | R18.2 71.12,60.96 71.12,68.58 68.58,71.12 58.42,71.12 55.88,73.66 55.88,78.74 53.34,81.28 52.07,82.55
  Bottom 0.813: D3.C 44.45,82.55 PWR_SW2.MP
  Bottom 1.016: 66.04,81.28 C20.1 IC4.6 | 66.04,81.28 53.34,81.28 | PWR_SW2.MP C19.+ 52.07,82.55 53.34,81.28 | 53.34,81.28 53.34,86.61 U$3.VIN | R17.1 66.04,81.28

### Text on the board
bNames: El Fueradoro